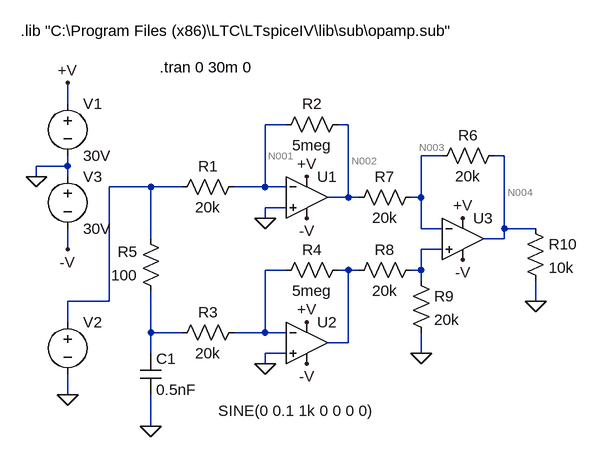
[diagram p0: schematic medidor capacitivo2.asc]
medidor capacitivo2.asc, the LTspice schematic file:
Version 4
SHEET 1 1244 680
WIRE -16 48 -16 16
WIRE 320 80 288 80
WIRE 416 80 400 80
WIRE 560 128 528 128
WIRE 656 128 640 128
WIRE -16 144 -16 128
WIRE -16 144 -64 144
WIRE -64 160 -64 144
WIRE -16 160 -16 144
WIRE 112 176 48 176
WIRE 160 176 112 176
WIRE 288 176 288 80
WIRE 288 176 240 176
WIRE 320 176 288 176
WIRE 416 192 416 80
WIRE 416 192 384 192
WIRE 432 192 416 192
WIRE 528 192 528 128
WIRE 528 192 512 192
WIRE 320 208 288 208
WIRE 288 224 288 208
WIRE 528 240 528 192
WIRE 560 240 528 240
WIRE 656 240 656 128
WIRE 704 240 656 240
WIRE 112 256 112 176
WIRE 656 256 656 240
WIRE 656 256 624 256
WIRE -16 272 -16 240
WIRE 560 272 528 272
WIRE 320 304 288 304
WIRE 416 304 400 304
WIRE 432 304 416 304
WIRE 528 304 528 272
WIRE 528 304 512 304
WIRE 528 320 528 304
WIRE 48 352 48 176
WIRE 48 352 -16 352
WIRE 704 352 704 320
WIRE -16 384 -16 352
WIRE 112 400 112 336
WIRE 160 400 112 400
WIRE 288 400 288 304
WIRE 288 400 240 400
WIRE 320 400 288 400
WIRE 416 416 416 304
WIRE 416 416 384 416
WIRE 112 432 112 400
WIRE 320 432 288 432
WIRE 528 432 528 400
WIRE 288 448 288 432
WIRE -16 496 -16 464
WIRE 112 544 112 496
FLAG -64 160 0
FLAG -16 16 +V
FLAG 352 160 +V
FLAG 288 224 0
FLAG -16 272 -V
FLAG 352 224 -V
FLAG 352 384 +V
FLAG 288 448 0
FLAG 352 448 -V
FLAG -16 496 0
FLAG 112 544 0
FLAG 592 224 +V
FLAG 592 288 -V
FLAG 528 432 0
FLAG 704 352 0
SYMBOL voltage -16 32 R0
WINDOW 123 0 0 Left 2
WINDOW 39 0 0 Left 2
SYMATTR InstName V1
SYMATTR Value 30V
SYMATTR Value2 ""
SYMATTR SpiceLine ""
SYMBOL Opamps\\UniversalOpamp2 352 192 R0
SYMATTR InstName U1
SYMBOL res 256 160 R90
WINDOW 0 0 56 VBottom 2
WINDOW 3 32 56 VTop 2
SYMATTR InstName R1
SYMATTR Value 20k
SYMBOL res 416 64 R90
WINDOW 0 0 56 VBottom 2
WINDOW 3 32 56 VTop 2
SYMATTR InstName R2
SYMATTR Value 5meg
SYMBOL voltage -16 144 R0
WINDOW 123 0 0 Left 2
WINDOW 39 0 0 Left 2
SYMATTR InstName V3
SYMATTR Value 30V
SYMATTR Value2 ""
SYMATTR SpiceLine ""
SYMBOL Opamps\\UniversalOpamp2 352 416 R0
SYMATTR InstName U2
SYMBOL res 256 384 R90
WINDOW 0 0 56 VBottom 2
WINDOW 3 32 56 VTop 2
SYMATTR InstName R3
SYMATTR Value 20k
SYMBOL res 416 288 R90
WINDOW 0 0 56 VBottom 2
WINDOW 3 32 56 VTop 2
SYMATTR InstName R4
SYMATTR Value 5meg
SYMBOL voltage -16 368 R0
WINDOW 3 232 152 Left 2
WINDOW 123 0 0 Left 2
WINDOW 39 0 0 Left 2
SYMATTR InstName V2
SYMATTR Value SINE(0 0.1 1k 0 0 0 0)
SYMATTR Value2 ""
SYMATTR SpiceLine ""
SYMBOL res 128 352 R180
WINDOW 0 36 76 Left 2
WINDOW 3 36 40 Left 2
SYMATTR InstName R5
SYMATTR Value 100
SYMATTR SpiceLine ""
SYMBOL cap 96 432 R0
SYMATTR InstName C1
SYMATTR Value 0.5nF
SYMBOL Opamps\\UniversalOpamp2 592 256 R0
SYMATTR InstName U3
SYMBOL res 544 144 R270
WINDOW 0 32 56 VTop 2
WINDOW 3 0 56 VBottom 2
SYMATTR InstName R6
SYMATTR Value 20k
SYMBOL res 416 208 R270
WINDOW 0 32 56 VTop 2
WINDOW 3 0 56 VBottom 2
SYMATTR InstName R7
SYMATTR Value 20k
SYMBOL res 416 320 R270
WINDOW 0 32 56 VTop 2
WINDOW 3 0 56 VBottom 2
SYMATTR InstName R8
SYMATTR Value 20k
SYMBOL res 512 304 R0
SYMATTR InstName R9
SYMATTR Value 20k
SYMBOL res 688 224 R0
SYMATTR InstName R10
SYMATTR Value 10k
TEXT 126 -8 Left 2 !.tran 0 30m 0
TEXT -88 -64 Left 2 !.lib "C:\\Program Files (x86)\\LTC\\LTspiceIV\\lib\\sub\\opamp.sub"

The netlist it stands for:
* medidor capacitivo2.asc
V1 +V 0 30V
XU1 0 N001 +V -V N002 level.2 Avol=1Meg GBW=10Meg Slew=10Meg ilimit=25m rail=0 Vos=0 phimargin=45 en=0 enk=0 in=0 ink=0 Rin=500Meg  ; pins IN+ IN- V+ V- OUT
R1 N001 N005 20k
R2 N002 N001 5meg
V3 0 -V 30V
XU2 0 N007 +V -V N008 level.2 Avol=1Meg GBW=10Meg Slew=10Meg ilimit=25m rail=0 Vos=0 phimargin=45 en=0 enk=0 in=0 ink=0 Rin=500Meg  ; pins IN+ IN- V+ V- OUT
R3 N007 N009 20k
R4 N008 N007 5meg
V2 N005 0 SINE(0 0.1 1k 0 0 0 0)
R5 N009 N005 100
C1 N009 0 0.5nF
XU3 N006 N003 +V -V N004 level.2 Avol=1Meg GBW=10Meg Slew=10Meg ilimit=25m rail=0 Vos=0 phimargin=45 en=0 enk=0 in=0 ink=0 Rin=500Meg  ; pins IN+ IN- V+ V- OUT
R6 N003 N004 20k
R7 N002 N003 20k
R8 N008 N006 20k
R9 N006 0 20k
R10 N004 0 10k
.tran 0 30m 0
.lib "C:\Program Files (x86)\LTC\LTspiceIV\lib\sub\opamp.sub"
.lib UniversalOpamps2.sub
.backanno
.end

* Results of the author's LTspice run, read from the files saved beside the schematic
* Operating Point, zero values left out:
*   V(+v) = 30 V
*   V(-v) = -30 V
*   I(V3) = -8.958 mA
*   I(V1) = -8.958 mA
*   Ix(u1:3) = 2.986 mA
*   Ix(u1:4) = -2.986 mA
*   Ix(u2:3) = 2.986 mA
*   Ix(u2:4) = -2.986 mA
*   Ix(u3:3) = 2.986 mA
*   Ix(u3:4) = -2.986 mA
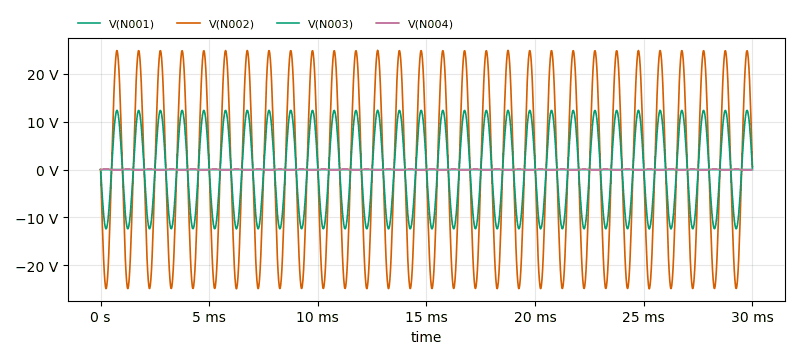
[diagram p1: Transient Analysis of medidor capacitivo2.asc, plotted from the saved traces]
* Transient Analysis, 1 run:
*   V(N001): min -2.486 mV, max 2.5 mV, average -366.4 nV, rms 1.758 mV, last 2.5 mV
*   V(N002): min -24.92 V, max 24.92 V, average -134.2 µV, rms 17.55 V, last 627.4 mV
*   V(N003): min -12.4 V, max 12.4 V, average -66.89 µV, rms 8.73 V, last 314.5 mV
*   V(N004): min -124 mV, max 124 mV, average 452.8 nV, rms 87.28 mV, last 1.531 mV